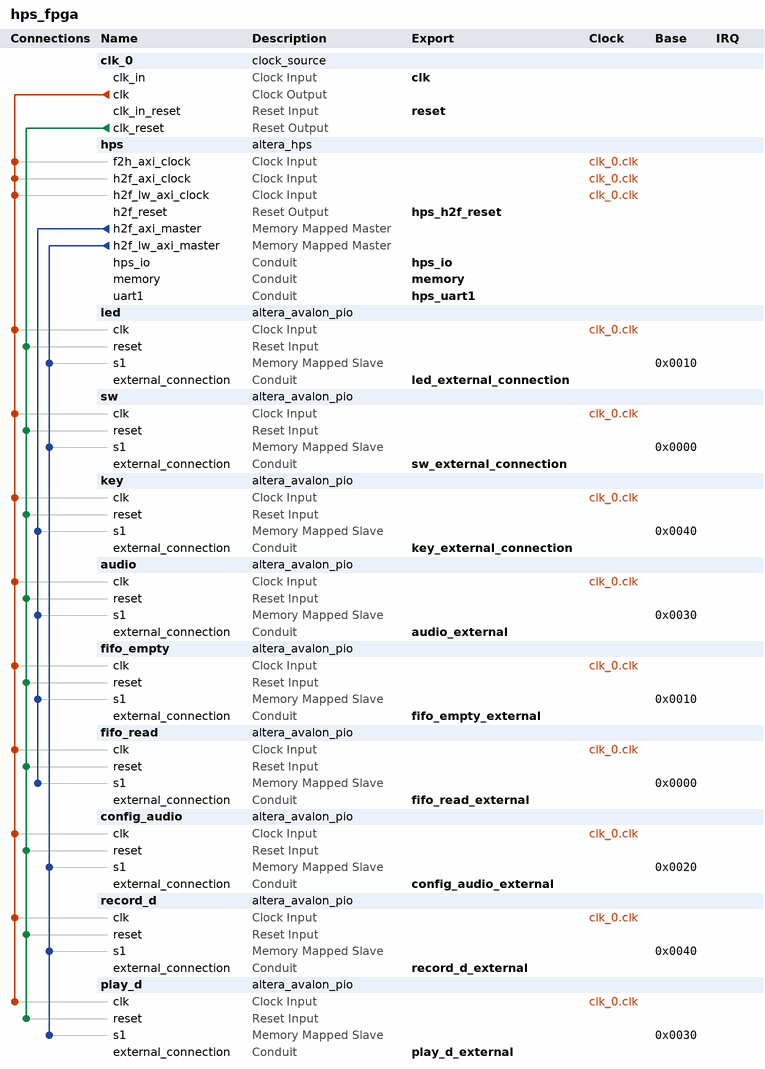
[diagram p0: system contents]
# Platform Designer (Qsys) system hps_fpga, Cyclone V 5CSEMA5F31C6
# Parameters at their usual value, and those the tool derives, are not listed.
package require -exact qsys 15.0
create_system hps_fpga
set_project_property DEVICE_FAMILY {Cyclone V}
set_project_property DEVICE 5CSEMA5F31C6

add_instance clk_0 clock_source 15.0
set_instance_parameter_value clk_0 clockFrequency 50000000

add_instance hps altera_hps 15.0
set_instance_parameter_value hps EMAC1_Mode RGMII
set_instance_parameter_value hps EMAC1_PinMuxing {HPS I/O Set 0}
set_instance_parameter_value hps F2SCLK_COLDRST_Enable false
set_instance_parameter_value hps F2SCLK_DBGRST_Enable false
set_instance_parameter_value hps F2SCLK_WARMRST_Enable false
set_instance_parameter_value hps F2SINTERRUPT_Enable false
set_instance_parameter_value hps F2S_Width 2
set_instance_parameter_value hps FPGA_PERIPHERAL_OUTPUT_CLOCK_FREQ_EMAC0_GTX_CLK 100
set_instance_parameter_value hps FPGA_PERIPHERAL_OUTPUT_CLOCK_FREQ_EMAC0_MD_CLK 100.0
set_instance_parameter_value hps FPGA_PERIPHERAL_OUTPUT_CLOCK_FREQ_EMAC1_GTX_CLK 100
set_instance_parameter_value hps FPGA_PERIPHERAL_OUTPUT_CLOCK_FREQ_EMAC1_MD_CLK 100.0
set_instance_parameter_value hps HPS_PROTOCOL DDR3
set_instance_parameter_value hps I2C0_Mode N/A
set_instance_parameter_value hps I2C0_PinMuxing Unused
set_instance_parameter_value hps I2C1_Mode N/A
set_instance_parameter_value hps I2C1_PinMuxing Unused
set_instance_parameter_value hps LWH2F_Enable true
set_instance_parameter_value hps MEM_BANKADDR_WIDTH 3
set_instance_parameter_value hps MEM_CLK_FREQ 400.0
set_instance_parameter_value hps MEM_COL_ADDR_WIDTH 10
set_instance_parameter_value hps MEM_DQ_WIDTH 32
set_instance_parameter_value hps MEM_DRV_STR RZQ/7
set_instance_parameter_value hps MEM_ROW_ADDR_WIDTH 15
set_instance_parameter_value hps MEM_RTT_NOM RZQ/4
set_instance_parameter_value hps MEM_RTT_WR {Dynamic ODT off}
set_instance_parameter_value hps MEM_TCL 11
set_instance_parameter_value hps MEM_TFAW_NS 30.0
set_instance_parameter_value hps MEM_TRAS_NS 35.0
set_instance_parameter_value hps MEM_TRCD_NS 13.75
set_instance_parameter_value hps MEM_TRFC_NS 260.0
set_instance_parameter_value hps MEM_TRP_NS 13.75
set_instance_parameter_value hps MEM_VENDOR JEDEC
set_instance_parameter_value hps MEM_WTCL 8
set_instance_parameter_value hps QSPI_Mode N/A
set_instance_parameter_value hps QSPI_PinMuxing Unused
set_instance_parameter_value hps REF_CLK_FREQ 25.0
set_instance_parameter_value hps S2F_Width 2
set_instance_parameter_value hps SDIO_Mode {4-bit Data}
set_instance_parameter_value hps SDIO_PinMuxing {HPS I/O Set 0}
set_instance_parameter_value hps SPIM1_Mode N/A
set_instance_parameter_value hps SPIM1_PinMuxing Unused
set_instance_parameter_value hps STM_Enable false
set_instance_parameter_value hps TIMING_BOARD_AC_SKEW 0.03
set_instance_parameter_value hps TIMING_BOARD_AC_TO_CK_SKEW 0.0
set_instance_parameter_value hps TIMING_BOARD_DQ_TO_DQS_SKEW 0.0
set_instance_parameter_value hps TIMING_BOARD_MAX_CK_DELAY 0.03
set_instance_parameter_value hps TIMING_BOARD_MAX_DQS_DELAY 0.02
set_instance_parameter_value hps TIMING_BOARD_SKEW_BETWEEN_DQS 0.08
set_instance_parameter_value hps TIMING_BOARD_SKEW_CKDQS_DIMM_MAX 0.16
set_instance_parameter_value hps TIMING_BOARD_SKEW_CKDQS_DIMM_MIN 0.09
set_instance_parameter_value hps TIMING_BOARD_SKEW_WITHIN_DQS 0.01
set_instance_parameter_value hps TIMING_TDH 65
set_instance_parameter_value hps TIMING_TDQSCK 255
set_instance_parameter_value hps TIMING_TDQSQ 125
set_instance_parameter_value hps TIMING_TDS 30
set_instance_parameter_value hps TIMING_TIH 140
set_instance_parameter_value hps TIMING_TIS 180
set_instance_parameter_value hps TIMING_TQSH 0.4
set_instance_parameter_value hps UART0_Mode {No Flow Control}
set_instance_parameter_value hps UART0_PinMuxing {HPS I/O Set 0}
set_instance_parameter_value hps UART1_Mode Full
set_instance_parameter_value hps UART1_PinMuxing FPGA
set_instance_parameter_value hps USB1_Mode SDR
set_instance_parameter_value hps USB1_PinMuxing {HPS I/O Set 0}
set_instance_parameter_value hps desired_cfg_clk_mhz 100.0
set_instance_parameter_value hps desired_qspi_clk_mhz 400.0

add_instance led altera_avalon_pio 15.0
set_instance_parameter_value led direction Output
set_instance_parameter_value led resetValue 1023
set_instance_parameter_value led width 10

add_instance sw altera_avalon_pio 15.0
set_instance_parameter_value sw direction Input
set_instance_parameter_value sw width 10

add_instance key altera_avalon_pio 15.0
set_instance_parameter_value key direction Input
set_instance_parameter_value key width 4

add_instance audio altera_avalon_pio 15.0
set_instance_parameter_value audio direction Input
set_instance_parameter_value audio width 32

add_instance fifo_empty altera_avalon_pio 15.0
set_instance_parameter_value fifo_empty direction Input
set_instance_parameter_value fifo_empty width 1

add_instance fifo_read altera_avalon_pio 15.0
set_instance_parameter_value fifo_read direction Output
set_instance_parameter_value fifo_read width 1

add_instance config_audio altera_avalon_pio 15.0
set_instance_parameter_value config_audio direction Output
set_instance_parameter_value config_audio width 10

add_instance record_d altera_avalon_pio 15.0
set_instance_parameter_value record_d direction Output
set_instance_parameter_value record_d width 1

add_instance play_d altera_avalon_pio 15.0
set_instance_parameter_value play_d direction Output
set_instance_parameter_value play_d width 1

# connections
add_connection clk_0.clk audio.clk clock
add_connection clk_0.clk config_audio.clk clock
add_connection clk_0.clk fifo_empty.clk clock
add_connection clk_0.clk fifo_read.clk clock
add_connection clk_0.clk hps.f2h_axi_clock clock
add_connection clk_0.clk hps.h2f_axi_clock clock
add_connection clk_0.clk hps.h2f_lw_axi_clock clock
add_connection clk_0.clk key.clk clock
add_connection clk_0.clk led.clk clock
add_connection clk_0.clk play_d.clk clock
add_connection clk_0.clk record_d.clk clock
add_connection clk_0.clk sw.clk clock
add_connection clk_0.clk_reset audio.reset reset
add_connection clk_0.clk_reset config_audio.reset reset
add_connection clk_0.clk_reset fifo_empty.reset reset
add_connection clk_0.clk_reset fifo_read.reset reset
add_connection clk_0.clk_reset key.reset reset
add_connection clk_0.clk_reset led.reset reset
add_connection clk_0.clk_reset play_d.reset reset
add_connection clk_0.clk_reset record_d.reset reset
add_connection clk_0.clk_reset sw.reset reset
add_connection hps.h2f_axi_master audio.s1 avalon
set_connection_parameter_value hps.h2f_axi_master/audio.s1 baseAddress 0x0030
add_connection hps.h2f_axi_master fifo_empty.s1 avalon
set_connection_parameter_value hps.h2f_axi_master/fifo_empty.s1 baseAddress 0x0010
add_connection hps.h2f_axi_master fifo_read.s1 avalon
set_connection_parameter_value hps.h2f_axi_master/fifo_read.s1 baseAddress 0x0000
add_connection hps.h2f_axi_master key.s1 avalon
set_connection_parameter_value hps.h2f_axi_master/key.s1 baseAddress 0x0040
add_connection hps.h2f_lw_axi_master config_audio.s1 avalon
set_connection_parameter_value hps.h2f_lw_axi_master/config_audio.s1 baseAddress 0x0020
add_connection hps.h2f_lw_axi_master led.s1 avalon
set_connection_parameter_value hps.h2f_lw_axi_master/led.s1 baseAddress 0x0010
add_connection hps.h2f_lw_axi_master play_d.s1 avalon
set_connection_parameter_value hps.h2f_lw_axi_master/play_d.s1 baseAddress 0x0030
add_connection hps.h2f_lw_axi_master record_d.s1 avalon
set_connection_parameter_value hps.h2f_lw_axi_master/record_d.s1 baseAddress 0x0040
add_connection hps.h2f_lw_axi_master sw.s1 avalon
set_connection_parameter_value hps.h2f_lw_axi_master/sw.s1 baseAddress 0x0000

# exported interfaces
add_interface audio_external conduit end
set_interface_property audio_external EXPORT_OF audio.external_connection
add_interface clk clock sink
set_interface_property clk EXPORT_OF clk_0.clk_in
add_interface config_audio_external conduit end
set_interface_property config_audio_external EXPORT_OF config_audio.external_connection
add_interface fifo_empty_external conduit end
set_interface_property fifo_empty_external EXPORT_OF fifo_empty.external_connection
add_interface fifo_read_external conduit end
set_interface_property fifo_read_external EXPORT_OF fifo_read.external_connection
add_interface hps_h2f_reset reset source
set_interface_property hps_h2f_reset EXPORT_OF hps.h2f_reset
add_interface hps_io conduit end
set_interface_property hps_io EXPORT_OF hps.hps_io
add_interface hps_uart1 conduit end
set_interface_property hps_uart1 EXPORT_OF hps.uart1
add_interface key_external_connection conduit end
set_interface_property key_external_connection EXPORT_OF key.external_connection
add_interface led_external_connection conduit end
set_interface_property led_external_connection EXPORT_OF led.external_connection
add_interface memory conduit end
set_interface_property memory EXPORT_OF hps.memory
add_interface play_d_external conduit end
set_interface_property play_d_external EXPORT_OF play_d.external_connection
add_interface record_d_external conduit end
set_interface_property record_d_external EXPORT_OF record_d.external_connection
add_interface reset reset sink
set_interface_property reset EXPORT_OF clk_0.clk_in_reset
add_interface sw_external_connection conduit end
set_interface_property sw_external_connection EXPORT_OF sw.external_connection

set_interconnect_requirement {$system} qsys_mm.clockCrossingAdapter HANDSHAKE
set_interconnect_requirement {$system} qsys_mm.insertDefaultSlave FALSE
set_interconnect_requirement {$system} qsys_mm.maxAdditionalLatency 1

save_system hps_fpga.qsys
